# Altium schematic sheet Class AB.schdoc
size 121 x 91 mm
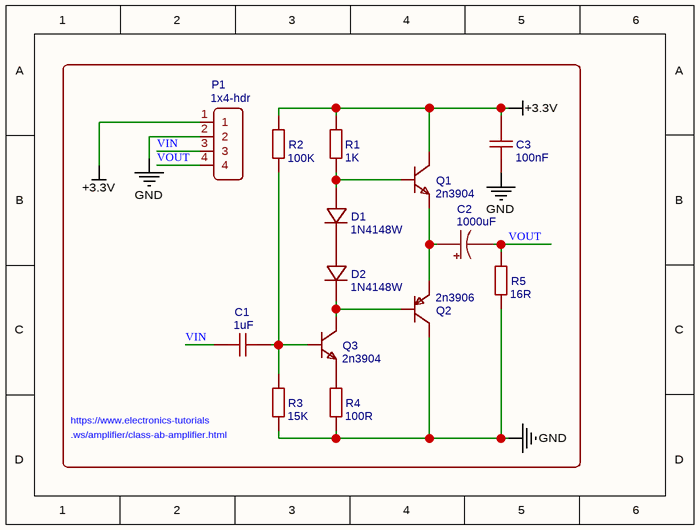
[diagram p0: Class AB.schdoc]

## Parts
C1  1uF  [C0603]
C2  1000uF  [CAP-SMD_BD10.0-L10.3-W10.3-FD]
C3  100nF  [C0603]
D1  1N4148W  [SOD-123_L2.8-W1.8-LS3.7-RD]
D2  1N4148W  [SOD-123_L2.8-W1.8-LS3.7-RD]
P1  1x4-hdr  [1X4-HDR]
Q1  2n3904  [SOT-23-3_L2.9-W1.3-P1.90-LS2.4-TR]
Q2  2n3906  [SOT-23-3_L2.9-W1.6-P1.90-LS2.8-TR-CW]
Q3  2n3904  [SOT-23-3_L2.9-W1.3-P1.90-LS2.4-TR]
R1  1K  [R0603]
R2  100K  [R0603]
R3  15K  [R0603]
R4  100R  [R0603]
R5  16R  [R0603]

## Nets
+3.3V: C3.1 P1.1 Q1.3(C) R1.2 R2.2
GND: C3.2 P1.2 Q2.3(C) R3.1 R4.1 R5.2
VIN: C1.1 P1.3
VOUT: C2.2 P1.4 R5.1
NetC1_2: C1.2 Q3.2(B) R2.1 R3.2
NetC2_1: C2.1 Q1.1(E) Q2.1(E)
NetD1_1: D1.1(C) D2.2(A)
NetD1_2: D1.2(A) Q1.2(B) R1.1
NetD2_1: D2.1(C) Q2.2(B) Q3.3(C)
NetQ3_1: Q3.1(E) R4.2

## Notes on the sheet
- https://www.electronics-tutorials
- (near R3) .ws/amplifier/class-ab-amplifier.html

## Library data of the parts
C1 = 1uF: BOM_Manufacturer: MuRata; BOM_Manufacturer Part: GRM188B31C105KA92D; nameAlias: Capacitance; BOM_Supplier: LCSC; BOM_Supplier Part: C85993; spicePre: C; spiceSymbolName: GRM188B31C105KA92D
C2 = 1000uF: BOM_Manufacturer: Lelon; BOM_Manufacturer Part: VEU102M0J1010-TRO; nameAlias: Capacitance; Contributor: LCSC; BOM_Supplier: LCSC; BOM_Supplier Part: C249735; spicePre: C; spiceSymbolName: VEU102M0J1010-TRO
C3 = 100nF: BOM_Manufacturer: Walsin Tech Corp; BOM_Manufacturer Part: 0603B104M500CT; nameAlias: Capacitance; Contributor: LCSC; BOM_Supplier: LCSC; BOM_Supplier Part: C388001; spicePre: C; spiceSymbolName: 0603B104M500CT
D1 D2 = 1N4148W: BOM_Manufacturer: SK; Contributor: LCSC; BOM_Supplier: LCSC; BOM_Supplier Part: C109203; BOM_Manufacturer Part: 1N4148W; spicePre: D; spiceSymbolName: 1N4148W_C109203
P1 = 1x4-hdr: Contributor: Ezra Wolf; spicePre: P; spiceSymbolName: 1x4-hdr
Q1 Q3 = 2n3904: BOM_Manufacturer: KEC; BOM_Manufacturer Part: 2n3904S-RTK/PS; SMT Type: Basic; BOM_Supplier: LCSC; image: //image.lceda.cn/szlcsc/C18536.jpg; BOM_Supplier Part: C18536; BOM_LCSC Assembly: Yes; spicePre: Q; spiceSymbolName: 2n3904S-RTK/PS_C18536
Q2 = 2n3906: BOM_Manufacturer: KEC; BOM_Manufacturer Part: 2N3906S-RTK/PS; Contributor: LCSC; SMT Type: Extend; BOM_Supplier: LCSC; BOM_Supplier Part: C147294; BOM_LCSC Assembly: Yes; spicePre: Q; spiceSymbolName: 2N3906S-RTK/PS
R1 = 1K: BOM_Manufacturer: Tyohm; BOM_Manufacturer Part: RMC06031K5%N; nameAlias: Resistance (Ohms); Contributor: LCSC; BOM_Supplier: LCSC; BOM_Supplier Part: C269685; spicePre: R; spiceSymbolName: RMC06031K5%N
R2 = 100K: BOM_Manufacturer: Shenzhen Eyang Tech Development; BOM_Manufacturer Part: R0603RXX104XJ10LTS; nameAlias: Resistance (Ohms); Contributor: LCSC; BOM_Supplier: LCSC; BOM_Supplier Part: C267258; spicePre: R; spiceSymbolName: R0603RXX104XJ10LTS
R3 = 15K: BOM_Manufacturer: Tyohm; BOM_Manufacturer Part: RMC060315K1%N; nameAlias: Resistance (Ohms); Contributor: LCSC; BOM_Supplier: LCSC; BOM_Supplier Part: C269703; spicePre: R; spiceSymbolName: RMC060315K1%N
R4 = 100R: BOM_Manufacturer: TA-I Tech; BOM_Manufacturer Part: RMS06FT1000; nameAlias: Resistance (Ohms); Contributor: LCSC; BOM_Supplier: LCSC; BOM_Supplier Part: C209011; spicePre: R; spiceSymbolName: RMS06FT1000
R5 = 16R: BOM_Manufacturer: RALEC; BOM_Manufacturer Part: RTT03160JTP; nameAlias: Resistance (Ohms); Contributor: LCSC; BOM_Supplier: LCSC; BOM_Supplier Part: C158940; spicePre: R; spiceSymbolName: RTT03160JTP